# Altium schematic sheet [5] High_Voltage.SchDoc
size A4; DocumentNumber: 7; SheetNumber: 8; SheetTotal: 10
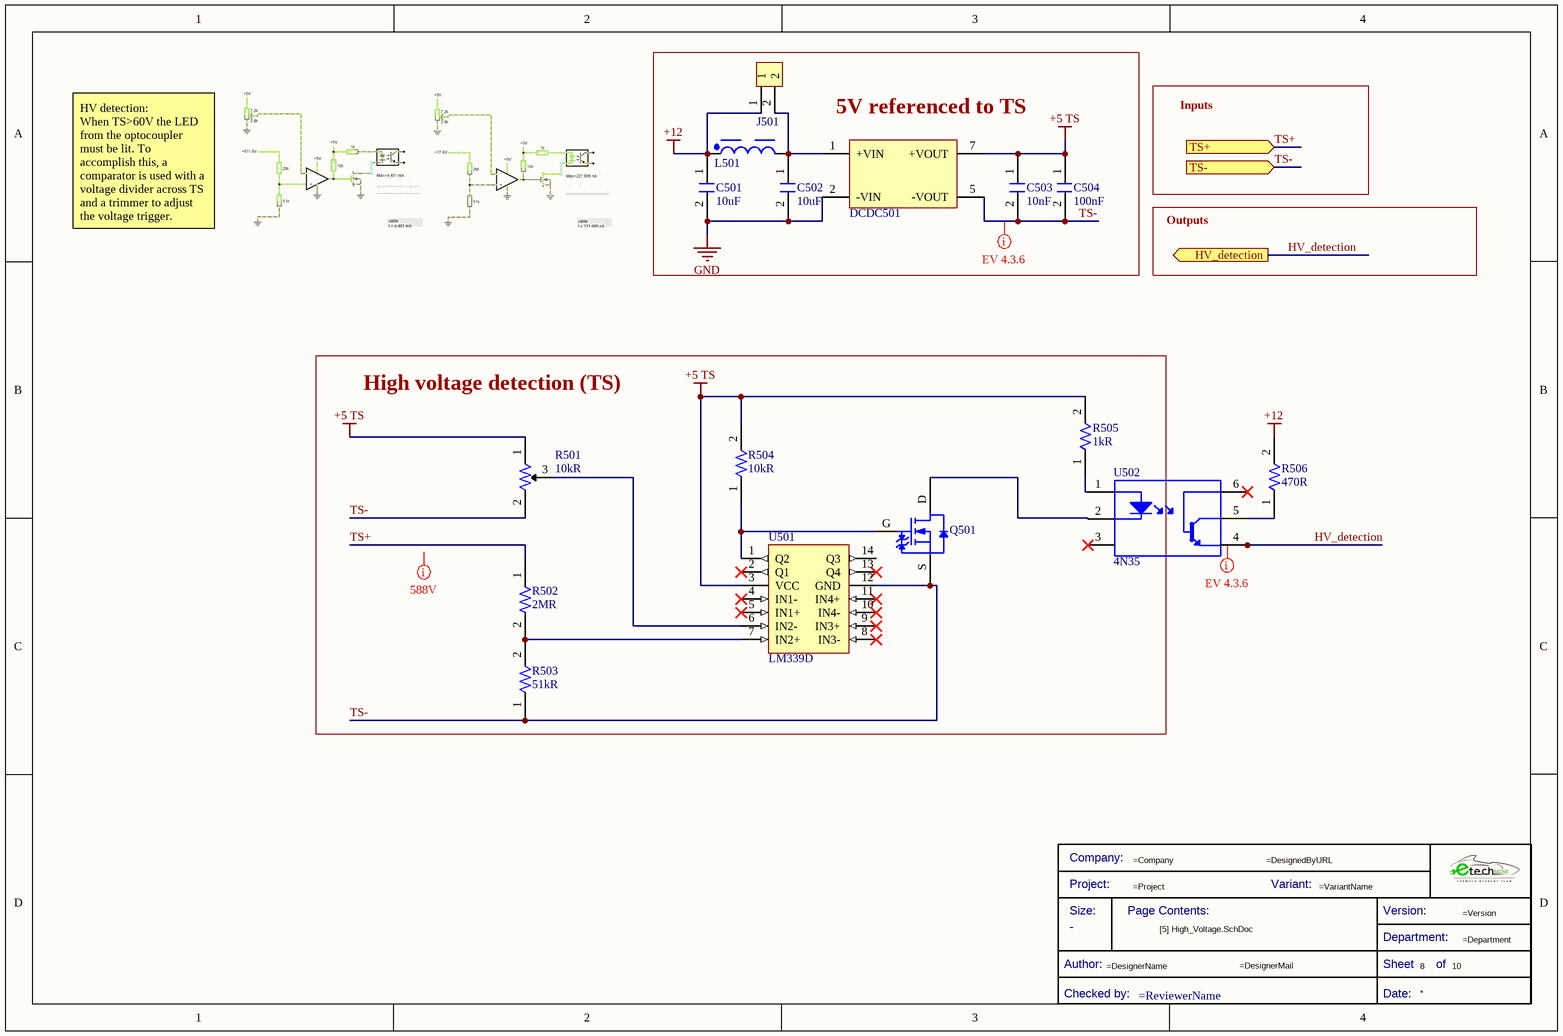
[diagram p0: [5] High_Voltage.SchDoc]

## Parts
*  Title Block_template  (value not drawn)  (graphical)
C501  Capacitance: 10uF  [C10u-50V-1210FNPMLCC-X7R]  (hidden comment: GRJ32ER71H106KE11L)
C502  Capacitance: 10uF  [C10u-50V-1210FNPMLCC-X7R]  (hidden comment: GRJ32ER71H106KE11L)
C503  Capacitance: 10nF  [C0805FNPC-R]  (hidden comment: 885012207092)
C504  Capacitance: 100nF  [C0805FNPC-R]  (hidden comment: 885012207098)
DCDC501  1779405241  [DCDC2W-ISO/1779405X41]  (value not drawn)
J501  61300211121  [J_Pinheader_1x2]  (value not drawn)
L501  744042470  [L_Power_ 47uH]  (value not drawn)
Q501  SQ2318BES-T1_GE3  [TRT-NCH-3/35-CPH]  (value not drawn)
R501  Resistance: 10kR  [R10k-VTR]  (hidden comment: 3296W-1-103LF)
R502  Resistance: 2MR  [R2512FTK]  (hidden comment: R2M-2512FTK)
R503  Resistance: 51kR  [R1206FTK-W]  (hidden comment: CRCW120610K0FKEA)
R504  Resistance: 10kR  [R0805FTK]  (hidden comment: CR0805-JW-103ELF)
R505  Resistance: 1kR  [R0805FTK]  (hidden comment: CR0805-JW-102ELF)
R506  Resistance: 470R  [R0805FTK]  (hidden comment: CR0805-FX-4700GLF)
U501  LM339D  [Array_4_Amp_LM339D]
U502  4N35  [Optocoupler_4N35]

## Blocks framed on the sheet
5V referenced to TS: C501-C504 DCDC501 J501 L501
High voltage detection (TS): Q501 R501-R505 U501

## Ports
HV_detection (out), TS+ (in), TS- (in)

## Nets
+5 TS: C503.1 C504.1 DCDC501.7(+VOUT) R501.1 R504.2 R505.2 U501.3(VCC)
+12: C501.1 J501.1 L501.1 R506.2
GND: C501.2 C502.2 DCDC501.2(-VIN)
HV_detection: U502.4(E) ; port HV_detection
TS+: R502.1 ; port TS+
TS-: C503.2 C504.2 DCDC501.5(-VOUT) Q501.S R501.2 R503.1 U501.12(GND) ; port TS-
NetC502_1: C502.1 DCDC501.1(+VIN) J501.2 L501.2
NetQ501_D: Q501.D U502.2(K)
NetQ501_G: Q501.G R504.1 U501.1(Q2)
NetR501_3: R501.3 U501.6(IN2-)
NetR502_2: R502.2 R503.2 U501.7(IN2+)
NetR505_1: R505.1 U502.1(A)
NetR506_1: R506.1 U502.5(E)

Not connected (* = marked no-connect by the designer): U501 2(Q1)* 4(IN1-)* 5(IN1+)* 8(IN3-)* 9(IN3+)* 10(IN4-)* 11(IN4+)* 13(Q4)* 14(Q3); U502 3(C)* 6(E)*

## Layout directives
mark named EV 4.3.6: (no net found under the mark), TS-
mark named 588V: (no net found under the mark)

## Notes on the sheet
- Inputs
- HV detection:
  When TS>60V the LED from the optocoupler must be lit. To accomplish this, a comparator is used with a voltage divider across TS and a trimmer to adjust the voltage trigger.
- Outputs
- (in symbol Title Block_template) Company:; Project:; Variant:; Size:; Page Contents:; Version:; Department:; Author:; Sheet; of; Checked by:; Date:

## Library data of the parts
* = Title Block_template: Standard Title Block; Category: Title Block; Checked by:: =ReviewerName; Size: -
C501 C502 = C10u-50V-1210FNPMLCC-X7R: Multilayer Ceramic Capacitors MLCC - SMD/SMT 1210 10uF 50volts X7R +/-10% Soft Term; Manufacturer: Murata; Voltage Rating: 50V; Tolerance: 10%; .Creator: DR; Supplier 1: Avnet; Manufacturer Part Number: GRJ32ER71H106KE11L; RoHS: Yes; Category: Ceramic Capacitors; Stock 1: 19000; Pricing 1: 1000=0,33327, 2000=0,32389, 4000=0,31450, 6000=0,30511, 8000=0,29572 (USD); Mount: Surface Mount; Case/Package: 1210; Case Code (Metric): 3225; Case Code (Imperial): 1210; Min Operating Temperature: -55°C; Max Operating Temperature: 125°C; Packaging: Tape and Reel; Features: Soft Termination; Length: 0.126inch; Width: 0.098inch; Thickness: 0.11inch; RoHS Compliant: Yes; ComponentLink1URL: https://eu.mouser.com/datasheet/2/281/GRJ32ER71H106KE11_01-1977929.pdf; ComponentLink1Description: Datasheet; Supplier Part Number 1: GRJ32ER71H106KE11L
C503 = C10n-50V-0805FNPC-X7R: Cap, 0.01ΜF, 50V, 10%, X7R, 0805; Manufacturer 1: Wurth Electronics; .Creator: DR; Supplier 1: RSComponents; Manufacturer Part Number 1: 885012207092; RoHS: Yes; Category: Ceramic Capacitors; Stock 1: 1; Pricing 1: 4000=0,03200, 12000=0,03100 (USD); Mount: Surface Mount; Case/Package: 0805; Case Code (Metric): 2012; Case Code (Imperial): 0805; Min Operating Temperature: -55°C; Max Operating Temperature: 125°C; Packaging: Cut Tape; Voltage Rating: 50V; Dielectric: X7R; Tolerance: 10%; Voltage Rating (DC): 50V; Length: 0.079inch; Width: 0.049inch; Thickness: 0.035inch; REACH SVHC: Unknown; RoHS Compliant: Yes; ComponentLink1URL: http://www.farnell.com/datasheets/1958497.pdf?src-supplier=Farnell; ComponentLink1Description: http://www.farnell.com/datasheets/1958497.pdf?src-supplier=Farnell; ComponentLink2URL: http://www.farnell.com/datasheets/1958497.pdf?src-supplier=Element14; ComponentLink2Description: http://www.farnell.com/datasheets/1958497.pdf?src-supplier=Element14; ComponentLink3URL: http://www.farnell.com/datasheets/1958497.pdf?src-supplier=Newark; ComponentLink3Description: http://www.farnell.com/datasheets/1958497.pdf?src-supplier=Newark; ComponentLink4URL: https://katalog.we-online.de/pbs/datasheet/885012207092.pdf?src-supplier=Digi-Key; ComponentLink4Description: https://katalog.we-online.de/pbs/datasheet/885012207092.pdf?src-supplier=Digi-Key; Supplier Part Number 1: 1813941
C504 = C100n-50V-0805FNPC-X7R: Cap, 0.1ΜF, 50V, 10%, X7R, 0805; Manufacturer 1: Wurth Electronics; .Creator: DR; Supplier 1: RSComponents; Manufacturer Part Number 1: 885012207098; RoHS: Yes; Category: Ceramic Capacitors; Stock 1: 8000; Pricing 1: 100=0,10200, 500=0,07100, 2000=0,06100 (GBP); Mount: Surface Mount; Case/Package: 0805; Case Code (Metric): 2012; Case Code (Imperial): 0805; Min Operating Temperature: -55°C; Max Operating Temperature: 125°C; Packaging: Cut Tape; Voltage Rating: 50V; Dielectric: X7R; Tolerance: 10%; Voltage Rating (DC): 50V; Length: 0.079inch; Width: 0.049inch; Thickness: 0.035inch; REACH SVHC: Unknown; RoHS Compliant: Yes; ComponentLink1URL: http://www.farnell.com/datasheets/1958498.pdf?src-supplier=Farnell; ComponentLink1Description: http://www.farnell.com/datasheets/1958498.pdf?src-supplier=Farnell; ComponentLink2URL: http://www.farnell.com/datasheets/1958498.pdf?src-supplier=Element14; ComponentLink2Description: http://www.farnell.com/datasheets/1958498.pdf?src-supplier=Element14; ComponentLink3URL: https://katalog.we-online.de/pbs/datasheet/885012207098.pdf?src-supplier=Digi-Key; ComponentLink3Description: https://katalog.we-online.de/pbs/datasheet/885012207098.pdf?src-supplier=Digi-Key; ComponentLink4URL: http://www.farnell.com/datasheets/1958498.pdf?src-supplier=Newark; ComponentLink4Description: http://www.farnell.com/datasheets/1958498.pdf?src-supplier=Newark; Supplier Part Number 1: 1813493
DCDC501 = DCDC-ISO-2W/12V/5V: WPME-FISM Fixed Isolated Module, SIP-7, 10.8-13.2Vin, 5Vout; Manufacturer: Wurth Elektronik; Input Voltage Max: 13.2V; Input Voltage Min: 10.8V; Input Voltage: 12V; Output Voltage: 5V; Isolation Voltage: 4kV; ComponentLink2Description: Datasheet; Height: 10.16mm; Packaging: Tube; Width: 7.05mm; ComponentLink2URL: https://www.we-online.com/catalog/datasheet/1779405141.pdf; Length: 19.65mm; Manufacturer Part Number: 1779405241; ComponentLink1Description: Manufacturer Link; Operating Temperature Max: 105°C; Mount: THT; ComponentLink1URL: http://www.we-online.de; Case/Size Code: SIP-7; Operating Temperature Min: -40°C; Component Type: MagI3C FISM
J501 = J_Jumper: CONN HEADER 2 POS 2.54; Manufacturer: Molex; Temperature rating: -40° to +105°C; Category type: PCB-PCB; Product name: Pin Header; Maximum current: 3 A; Maximum voltage: 250 V AC; Connections: 1x2; Current Rating: 3A; Voltage Rating: 250V; Number of Positions: 2; Gender: Male; Connector Type: Male Pin; Pitch: 0.1inch; .Creator: GP; Category: Connector; ComponentLink1Description: Datasheet; ComponentLink1URL: https://www.we-online.com/catalog/datasheet/61300211121.pdf; ComponentLink2Description: Where buy it; ComponentLink2URL: https://www.we-online.com/catalog/en/PHD_2_54_THT_PIN_HEADER_6130XX11121?sq=61300211121&sp=https%3A%2F%2Fwww.we-online.com%2Fweb%2Fen%2Fwuerth_elektronik%2Fsearchpage.php%3Fsearch%3D61300211121#61300211121; Manufacturer part number: 61300211121; Supplier: Würth Elektronik; RoHS: *; Application: Shortcircuit; Flammability: 94V-0; Orientation: Vertical; Mount: Through hole; Supplier 1: RSComponents; Stock 1: 1855; Pricing 1: 5=0,14100, 50=0,09700, 100=0,07800, 200=0,07300, 500=0,06800 (USD); Contact Plating: Gold; Housing Material: PBT; Contact Material: Copper Alloy,Copper; Color: Black; Min Operating Temperature: -40°C; Max Operating Temperature: 125°C; Number of Rows: 1; Contact Gender: Male; Packaging: Bulk; Termination: Through Hole; Number of Contacts: 2; Contact Mating Length: 0.236inch; REACH SVHC: Unknown; Lead Free: Lead Free; ComponentLink3URL: https://datasheet.ciiva.com/13619/6130xx11121-48870-13619345.pdf?src-supplier=Mouser; ComponentLink3Description: https://datasheet.ciiva.com/13619/6130xx11121-48870-13619345.pdf?src-supplier=Mouser; Supplier Part Number 1: 8281581
L501 = L_47uH_0.6A: WE-TPC SMT Tiny Power Inductor, size 4818, 47uH, 0.62A, 540mOhm; Manufacturer: Wurth Elektronik; Case/Size Code: 4818; Saturation Current: 0.45A; Self Resonant Frequency: 15MHz; Manufacturer Part Number: 744042470; Category: Power Inductors; Match Code: WE-TPC; ComponentLink1Description: Website Link; ComponentLink1URL: https://www.we-online.com/redexpert/article/744042470?ad; ComponentLink2Description: Datasheet Link; ComponentLink2URL: https://www.we-online.com/redexpert/spec/744042470?ad; Mount: Surface Mount; Operating Temperature Max: 125°C; Operating Temperature Min: -40°C; Packaging: Tape and Reel; Length: 4.8mm; Width: 4.8mm; Height: 1.8mm; DC Resistance: 540mOhm; Inductance: 47uH; Rated Current: 0.62A
Q501 = TRT-NCH-8/40-SQ: Automotive N-channel 40 V (d-s) 175C Mosfet SOT-23; Manufacturer 1: Vishay; Id: 8A; Vds: 40V; .Creator: DO; Supplier 1: Newark; Manufacturer Part Number 1: SQ2318BES-T1_GE3; RoHS: No; Pricing 1: 1=0,71500, 5=0,71500, 10=0,64400, 25=0,59000, 50=0,52500, 100=0,47100, 250=0,40800 (USD); Supplier Part Number 1: 81AH9290; ComponentLink1Description: Where to buy; ComponentLink1URL: https://www.mouser.es/ProductDetail/Vishay-Siliconix/SQ2318BES-T1_GE3?qs=sPbYRqrBIVmyZcxPsDt0vA%3D%3D; ComponentLink2Description: Datasheet; ComponentLink2URL: https://www.mouser.es/datasheet/2/427/sq2318bes-1868475.pdf
R501 = R10k-VTR: Trimmer, Cermet, Rest 10 Kilohms, PCB, 25 Turns, Pwr-Rtg 0.5W, 3296 Series; Manufacturer: Bourns; Tolerance: 10%; Power Rating: 500mW; Number of Turns: 25; Temperature Coefficient: 100ppm/°C; Insulation Resistance: 1GR; .Creator: DO; Supplier 1: RSComponents; Manufacturer Part Number: 3296W-1-103LF; RoHS: Yes; Category: Variable Resistors and Potentiometers; Stock 1: 3300; Pricing 1: 50=2,54800, 100=2,31900, 200=2,14000, 300=1,88400, 500=1,55300 (USD); Mount: PCB,Through Hole; Weight: 0.03oz; Color: Blue; Contact Plating: Tin,Matte; Min Operating Temperature: -55°C; Max Operating Temperature: 125°C; Packaging: Rail/Tube; Package Quantity: 50; Termination: Pin; Resistor Type: Cermet; Technology: CERMET; Taper: Linear; Max Power Dissipation: 500mW; Series: 3296; Resistance Tolerance: 10%; Length: 9.53mm; Width: 9.53mm; Height: 0.395inch; Depth: 4.83mm; Radiation Hardening: No; REACH SVHC: No SVHC; Military Standard: Not; Lead Free: Lead Free; RoHS Compliant: Yes; ComponentLink1URL: https://datasheet.ciiva.com/19454/853572-19454866.pdf?src-supplier=Jameco; ComponentLink1Description: https://datasheet.ciiva.com/19454/853572-19454866.pdf?src-supplier=Jameco; ComponentLink2URL: https://datasheet.ciiva.com/11830/0900766b8069ccf4-11830871.pdf?src-supplier=RSComponents; ComponentLink2Description: https://datasheet.ciiva.com/11830/0900766b8069ccf4-11830871.pdf?src-supplier=RSComponents; ComponentLink3URL: https://datasheet.ciiva.com/29122/447277-da-01-en-trimmer-tht3296w-1-103lf-10k-0-5w-29122362.pdf?src-supplier=Conrad; ComponentLink3Description: https://datasheet.ciiva.com/29122/447277-da-01-en-trimmer-tht3296w-1-103lf-10k-0-5w-29122362.pdf?src-supplier=Conrad; ComponentLink4URL: https://datasheet.ciiva.com/26913/3296w-1-103lf-26913885.pdf?src-supplier=IIIC; ComponentLink4Description: https://datasheet.ciiva.com/26913/3296w-1-103lf-26913885.pdf?src-supplier=IIIC; ComponentLink5URL: https://datasheet.ciiva.com/1131/1815117-1131273.pdf?src-supplier=Element14; ComponentLink5Description: https://datasheet.ciiva.com/1131/1815117-1131273.pdf?src-supplier=Element14; ComponentLink6URL: https://datasheet.ciiva.com/18411/70153578-18411561.pdf?src-supplier=Allied+Electronics; ComponentLink6Description: https://datasheet.ciiva.com/18411/70153578-18411561.pdf?src-supplier=Allied+Electronics; ComponentLink7URL: https://datasheet.ciiva.com/3266/3296-3266187.pdf?src-supplier=Avnet; ComponentLink7Description: https://datasheet.ciiva.com/3266/3296-3266187.pdf?src-supplier=Avnet; ComponentLink8URL: https://datasheet.ciiva.com/30093/3296-30093899.pdf?src-supplier=Onlinecomponents.com; ComponentLink8Description: https://datasheet.ciiva.com/30093/3296-30093899.pdf?src-supplier=Onlinecomponents.com; ComponentLink9URL: https://datasheet.ciiva.com/2156/3296-2156893.pdf?src-supplier=Digi-Key; ComponentLink9Description: https://datasheet.ciiva.com/2156/3296-2156893.pdf?src-supplier=Digi-Key; ComponentLink10URL: https://datasheet.ciiva.com/14173/ew3296-dat-e-14173022.pdf?src-supplier=Distrelec; ComponentLink10Description: https://datasheet.ciiva.com/14173/ew3296-dat-e-14173022.pdf?src-supplier=Distrelec; Supplier Part Number 1: 1673377; ComponentLink11Description: Where buy it; ComponentLink11URL: https://es.rs-online.com/web/p/potenciometros-de-ajuste/5219647
R502 = R2M-2512FTK: Current Sense Resistors - SMD 3watts .002ohms 1%; Manufacturer: Vishay Dale; Manufacturer Part Number: WSLP25122L000FEA; Temperature Coefficient: 275ppm/°C; Power Rating: 3W; Supplier 1: Mouser; RoHS: Yes; Category: Chip SMD Resistors; Stock 1: 11994; Pricing 1: 1=1,07000, 10=1,07000, 50=1,07000, 100=1,07000, 1000=0,77100, 10000=0,75500 (USD); Mount: Surface Mount; Case/Package: 2512; Case Code (Imperial): 2512; Case Code (Metric): 6432; Weight: 0.001429oz; Size Code: 2512; Min Operating Temperature: -65°C; Max Operating Temperature: 170°C; Tolerance: 1%; Packaging: Tape and Reel; Resistor Type: Metal Strip; Package Quantity: 2000; Termination: SMD/SMT; Series: WSLP; Length: 6.4mm; Width: 3.2mm; Height: 0.635mm; RoHS Compliant: Yes; Lead Free: Lead Free; ComponentLink1URL: https://datasheet.ciiva.com/48527/wslp-48527354.pdf?src-supplier=Avnet; ComponentLink1Description: https://datasheet.ciiva.com/48527/wslp-48527354.pdf?src-supplier=Avnet; Supplier Part Number 1: 71-WSLP25122L000FEA
R503 = R51k-1206FTK: Res Thick Film 1206 51K Ohm 1% 1/4W ±100ppm/°C Molded SMD SMD Punched Carrier T/R; Manufacturer: Panasonic; Manufacturer Part Number: ERJ-S08F5102V; Power Rating: 250mW; Voltage Rating: 150V; Voltage Rating (DC): 200V; Current Rating: 2A; .Creator: DO; Category: Resistor; ComponentLink1Description: Datasheet; ComponentLink1URL: https://docs.rs-online.com/bca8/A700000006404581.pdf; ComponentLink2Description: Where buy it; ComponentLink2URL: https://es.rs-online.com/web/p/resistencias-de-montaje-en-superficie/6791765; Supplier 1: Mouser; RoHS: Yes; Stock 1: 4091; Pricing 1: 1=0,31000, 10=0,26700, 50=0,26700, 100=0,10700, 1000=0,05100, 10000=0,03400 (USD); Mount: Surface Mount; Case/Package: 1206; Case Code (Metric): 3216; Case Code (Imperial): 1206; Contact Plating: Tin; Min Operating Temperature: -55°C; Max Operating Temperature: 155°C; Packaging: Tape and Reel; Tolerance: 1%; Package Quantity: 5000; Resistor Type: Thick Film; Number of Terminations: 2; Temperature Coefficient: 100ppm/°C; Max Power Dissipation: 250mW; Features: Anti-Sulfur; Series: ERJ; Construction: Rectangular; Length: 3.2mm; Width: 0.063inch; Height: 0.028inch; Depth: 1.6mm; Military Standard: Not; Lead Free: Lead Free; RoHS Compliant: Yes; ComponentLink3URL: https://datasheet.ciiva.com/24023/aoa0000ce5-24023518.pdf?src-supplier=Mouser; ComponentLink3Description: https://datasheet.ciiva.com/24023/aoa0000ce5-24023518.pdf?src-supplier=Mouser; ComponentLink4URL: https://datasheet.ciiva.com/9189/aoa0000ce5-9189211.pdf?src-supplier=Avnet; ComponentLink4Description: https://datasheet.ciiva.com/9189/aoa0000ce5-9189211.pdf?src-supplier=Avnet; Supplier Part Number 1: 667-ERJ-S08F5102V
R504 = R10k-0805FTK: BOURNS         CR0805-JW-103ELF            Surface Mount Chip Resistor, Thick Film, CR Series, 10 kohm, 125 mW,  5%, 150 V; Temperature Coefficient: 200ppm/°C; Power Rating: 125mW; Voltage Rating: 150V; Voltage Rating (DC): 100V; .Creator: DR; Supplier 1: Arrow Electronics; Manufacturer 1: Bourns; Manufacturer Part Number 1: CR0805-JW-103ELF; RoHS: Yes; Category: Chip SMD Resistors; Stock 1: 57566; Pricing 1: 1=0,05790, 10=0,01540, 25=0,01340, 100=0,00340 (USD); Mount: Surface Mount; Case/Package: 0805; Number of Pins: 2; Contact Plating: Tin; Case Code (Metric): 2012; Case Code (Imperial): 0805; Min Operating Temperature: -55°C; Max Operating Temperature: 155°C; Tolerance: 5%; Resistor Type: Thick Film; Package Quantity: 1; Packaging: Tape and Reel; Number of Terminations: 2; Termination: SMD/SMT; Max Power Dissipation: 125mW; Features: Moisture Resistant; Series: CR0805; Construction: Rectangular; Resistance Tolerance: 5%; Technology: THICK FILM; Length: 2mm; Width: 1.25mm; Height: 0.5mm; Depth: 1.25mm; Thickness: 508um; Radiation Hardening: No; REACH SVHC: No SVHC; Military Standard: Not; RoHS Compliant: Yes; ComponentLink1URL: https://datasheet.ciiva.com/11821/0900766b80fcdb72-11821135.pdf?src-supplier=RSComponents; ComponentLink1Description: https://datasheet.ciiva.com/11821/0900766b80fcdb72-11821135.pdf?src-supplier=RSComponents; ComponentLink2URL: https://datasheet.ciiva.com/9122/chpreztr-9122374.pdf?src-supplier=Avnet; ComponentLink2Description: https://datasheet.ciiva.com/9122/chpreztr-9122374.pdf?src-supplier=Avnet; ComponentLink3URL: https://datasheet.ciiva.com/22693/1902866-22693254.pdf?src-supplier=Element14; ComponentLink3Description: https://datasheet.ciiva.com/22693/1902866-22693254.pdf?src-supplier=Element14; ComponentLink4URL: https://datasheet.ciiva.com/7986/691949-7986187.pdf?src-supplier=Element14; ComponentLink4Description: https://datasheet.ciiva.com/7986/691949-7986187.pdf?src-supplier=Element14; ComponentLink5URL: https://datasheet.ciiva.com/30065/159chpreztr-30065976.pdf?src-supplier=Onlinecomponents.com; ComponentLink5Description: https://datasheet.ciiva.com/30065/159chpreztr-30065976.pdf?src-supplier=Onlinecomponents.com; ComponentLink6URL: https://datasheet.ciiva.com/16783/70154685-16783482.pdf?src-supplier=Allied+Electronics; ComponentLink6Description: https://datasheet.ciiva.com/16783/70154685-16783482.pdf?src-supplier=Allied+Electronics; ComponentLink7URL: https://datasheet.ciiva.com/5548/chpreztr-5548491.pdf?src-supplier=Mouser; ComponentLink7Description: https://datasheet.ciiva.com/5548/chpreztr-5548491.pdf?src-supplier=Mouser; ComponentLink8URL: https://datasheet.ciiva.com/6559/chpreztr-6559900.pdf?src-supplier=Digi-Key; ComponentLink8Description: https://datasheet.ciiva.com/6559/chpreztr-6559900.pdf?src-supplier=Digi-Key; ComponentLink9URL: https://datasheet.ciiva.com/6559/chpreztr-6559901.pdf?src-supplier=Digi-Key; ComponentLink9Description: https://datasheet.ciiva.com/6559/chpreztr-6559901.pdf?src-supplier=Digi-Key; ComponentLink10URL: https://datasheet.ciiva.com/7985/1856384-7985869.pdf?src-supplier=Element14; ComponentLink10Description: https://datasheet.ciiva.com/7985/1856384-7985869.pdf?src-supplier=Element14; ComponentLink11URL: https://datasheet.ciiva.com/48692/001055517-da-01-en-smd-wid-cr0805-jw-103elf-10k-ohm-1-8w-48692118.pdf?src-supplier=Conrad; ComponentLink11Description: https://datasheet.ciiva.com/48692/001055517-da-01-en-smd-wid-cr0805-jw-103elf-10k-ohm-1-8w-48692118.pdf?src-supplier=Conrad; Supplier Part Number 1: CR0805-JW-103ELF
R505 = R1k-0805FTK: Res Thick Film 0805 1K Ohm 5% 1/8W ±200ppm/°C Molded SMD SMD Paper Tape on Plastic Reel; Manufacturer 1: Bourns; Voltage Rating (DC): 150V; Power Rating: 125mW; .Creator: GP; Supplier 1: Arrow Electronics; Manufacturer Part Number 1: CR0805-JW-102ELF; RoHS: Yes; Category: Chip SMD Resistors; Stock 1: 27510; Pricing 1: 1=0,05930, 10=0,03510, 25=0,01790, 100=0,00800, 250=0,00790, 500=0,00590, 1000=0,00360, 3000=0,00350, 6000=0,00250 (USD); Mount: Surface Mount; Case/Package: 0805; Number of Pins: 2; Contact Plating: Tin; Case Code (Metric): 2012; Case Code (Imperial): 0805; Min Operating Temperature: -55°C; Max Operating Temperature: 155°C; Resistor Type: Thick Film; Tolerance: 5%; Temperature Coefficient: 200ppm/°C; Features: Moisture Resistant; Package Quantity: 1; Packaging: Tape and Reel; Voltage Rating: 150V; Number of Terminations: 2; Termination: SMD/SMT; Max Power Dissipation: 125mW; Length: 2mm; Width: 1.25mm; Height: 0.5mm; Thickness: 508um; Depth: 1.25mm; Radiation Hardening: No; Lead Free: Lead Free; REACH SVHC: No SVHC; Military Standard: Not; ComponentLink1URL: https://datasheet.ciiva.com/11821/0900766b80fcdb72-11821134.pdf?src-supplier=RSComponents; ComponentLink1Description: https://datasheet.ciiva.com/11821/0900766b80fcdb72-11821134.pdf?src-supplier=RSComponents; ComponentLink2URL: https://datasheet.ciiva.com/15225/getdatasheetpartid-78155-15225381.pdf?src-supplier=Verical; ComponentLink2Description: https://datasheet.ciiva.com/15225/getdatasheetpartid-78155-15225381.pdf?src-supplier=Verical; ComponentLink3URL: https://datasheet.ciiva.com/22693/1902866-22693253.pdf?src-supplier=Element14; ComponentLink3Description: https://datasheet.ciiva.com/22693/1902866-22693253.pdf?src-supplier=Element14; ComponentLink4URL: https://datasheet.ciiva.com/7986/1856384-7986184.pdf?src-supplier=Element14; ComponentLink4Description: https://datasheet.ciiva.com/7986/1856384-7986184.pdf?src-supplier=Element14; ComponentLink5URL: https://datasheet.ciiva.com/7985/1856384-7985867.pdf?src-supplier=Element14; ComponentLink5Description: https://datasheet.ciiva.com/7985/1856384-7985867.pdf?src-supplier=Element14; ComponentLink6URL: https://datasheet.ciiva.com/30242/159chpreztr-30242765.pdf?src-supplier=Onlinecomponents.com; ComponentLink6Description: https://datasheet.ciiva.com/30242/159chpreztr-30242765.pdf?src-supplier=Onlinecomponents.com; ComponentLink7URL: https://datasheet.ciiva.com/6547/chpreztr-6547359.pdf?src-supplier=Digi-Key; ComponentLink7Description: https://datasheet.ciiva.com/6547/chpreztr-6547359.pdf?src-supplier=Digi-Key; Supplier Part Number 1: CR0805-JW-102ELF
R506 = R470-0805FTK: Res Thick Film 0805 470 Ohm 1% 1/8W ±100ppm/°C Molded SMD SMD Paper Tape on Plastic Reel; Manufacturer 1: Bourns; Power Rating: 125mW; Voltage Rating: 150V; .Creator: DR; Supplier 1: Arrow Electronics; Manufacturer Part Number 1: CR0805-FX-4700GLF; RoHS: Yes; Category: Chip SMD Resistors; Stock 1: 12623; Pricing 1: 1=0,00990, 10=0,00980, 25=0,00950, 50=0,00940, 100=0,00930, 250=0,00920, 500=0,00910, 1000=0,00890, 3000=0,00870, 6000=0,00860 (USD); Mount: Surface Mount; Case/Package: 0805; Number of Pins: 2; Case Code (Imperial): 0805; Case Code (Metric): 2012; Contact Plating: Tin; Min Operating Temperature: -55°C; Max Operating Temperature: 155°C; Packaging: Tape and Reel; Tolerance: 1%; Resistor Type: Thick Film; Termination: SMD/SMT; Temperature Coefficient: 100ppm/°C; Voltage Rating (DC): 150V; Features: Moisture Resistant; Series: CR0805; Max Power Dissipation: 125mW; Number of Terminations: 2; Resistance Tolerance: 1%; Construction: Rectangular; Technology: THICK FILM; Length: 2mm; Height: 0.5mm; Depth: 1.25mm; Thickness: 508um; Radiation Hardening: No; REACH SVHC: No SVHC; Military Standard: Not; ComponentLink1URL: https://datasheet.ciiva.com/11808/0900766b80fcdb72-11808686.pdf?src-supplier=RSComponents; ComponentLink1Description: https://datasheet.ciiva.com/11808/0900766b80fcdb72-11808686.pdf?src-supplier=RSComponents; ComponentLink2URL: https://datasheet.ciiva.com/7985/1856384-7985880.pdf?src-supplier=Element14; ComponentLink2Description: https://datasheet.ciiva.com/7985/1856384-7985880.pdf?src-supplier=Element14; ComponentLink3URL: https://datasheet.ciiva.com/22693/1902866-22693247.pdf?src-supplier=Element14; ComponentLink3Description: https://datasheet.ciiva.com/22693/1902866-22693247.pdf?src-supplier=Element14; ComponentLink4URL: https://datasheet.ciiva.com/5541/chpreztr-5541930.pdf?src-supplier=Mouser; ComponentLink4Description: https://datasheet.ciiva.com/5541/chpreztr-5541930.pdf?src-supplier=Mouser; Supplier Part Number 1: CR0805-FX-4700GLF
U501 = Array_4_Amp_LM339D: Comparator Quad ±18V/36V 14-Pin SOIC Tube; Manufacturer: Texas Instruments; Number of Channels: 4; Nominal Supply Current: 2mA; Output Current: 20mA; Quiescent Current: 2.5mA; Max Supply Voltage: 30V; Min Supply Voltage: 2V; Min Dual Supply Voltage: 1V; Max Dual Supply Voltage: 15V; Voltage Gain: 106.02dB; Max Supply Current: 500uA; Input Bias Current: 250nA; Output Current per Channel: 6mA; Input Offset Voltage (Vos): 5mV; Response Time: 0.3us; Output Type: TTL; Dual Supply Voltage: 9V; .Creator: DO; Supplier 1: Digi-Key; RoHS: Yes; Category: Amplifiers - Op Amps, Buffer, Instrumentation; Stock 1: 10834; Pricing 1: 1=0,93000, 10=0,83500, 25=0,79240, 100=0,65090, 250=0,60848, 500=0,53774, 1000=0,46725 (USD); Mount: Surface Mount; Case/Package: SOIC; Number of Pins: 14; Contact Plating: Gold; Weight: 0.004318oz; Min Operating Temperature: 0°C; Max Operating Temperature: 70°C; Packaging: Rail/Tube; Package Quantity: 50; Number of Elements: 4; Supply Current: 2mA; Technology: BIPOLAR; Max Input Current: 250nA; Series: LM339; Length: 8.65mm; Width: 3.91mm; Height: 1.58mm; Radiation Hardening: No; REACH SVHC: No SVHC; Lead Free: Lead Free; RoHS Compliant: Yes; ComponentLink1URL: https://datasheet.ciiva.com/15131/getdatasheetpartid-248452-15131099.pdf?src-supplier=Verical; ComponentLink1Description: https://datasheet.ciiva.com/15131/getdatasheetpartid-248452-15131099.pdf?src-supplier=Verical; ComponentLink2URL: https://datasheet.ciiva.com/1483/1831045-1483000.pdf?src-supplier=Element14; ComponentLink2Description: https://datasheet.ciiva.com/1483/1831045-1483000.pdf?src-supplier=Element14; ComponentLink3URL: https://datasheet.ciiva.com/1827/lm139a-1827534.pdf?src-supplier=Digi-Key; ComponentLink3Description: https://datasheet.ciiva.com/1827/lm139a-1827534.pdf?src-supplier=Digi-Key; ComponentLink4URL: https://datasheet.ciiva.com/2970/lm2901-2970484.pdf?src-supplier=Avnet; ComponentLink4Description: https://datasheet.ciiva.com/2970/lm2901-2970484.pdf?src-supplier=Avnet; ComponentLink5URL: https://datasheet.ciiva.com/48712/001010753-da-01-en-ic-quad-diff-comp-lm339d-soic-14-tid-48712470.pdf?src-supplier=Conrad; ComponentLink5Description: https://datasheet.ciiva.com/48712/001010753-da-01-en-ic-quad-diff-comp-lm339d-soic-14-tid-48712470.pdf?src-supplier=Conrad; Supplier Part Number 1: 296-1013-5-ND; ComponentLink6Description: Where buy it; ComponentLink6URL: https://es.rs-online.com/web/p/comparadores/0858411; Manufacturer Part Number: LM339D
U502 = Optocoupler_4N35: Optocoupler DC-IN 1-CH Transistor With Base DC-OUT 6-Pin PDIP SMD T/R; Manufacturer: Vishay Lite-On; Manufacturer Part Number: CNY17-4S-TA1; Number of Channels: 1; Max Power Dissipation: 250mW; Isolation Voltage: 5kV; Output Voltage: 70V; Forward Voltage: 1.65V; Rise Time: 10000ns; Collector Emitter Saturation Voltage: 300mV; Max Input Current: 60mA; Reverse Breakdown Voltage: 6V; Input Type: DC; Current Transfer Ratio: 320%; Output Current per Channel: 150mA; .Creator: DO; Supplier 1: RSComponents; RoHS: Yes; Category: Optocouplers; Stock 1: 1; Pricing 1: 50=0,27200, 250=0,25600, 500=0,24000, 1250=0,22500, 2500=0,21200 (USD); Mount: Surface Mount; Case/Package: SMD/SMT; Number of Pins: 6; Min Operating Temperature: -55°C; Max Operating Temperature: 100°C; Packaging: Tape and Reel; Package Quantity: 1000; Power Dissipation: 250mW; Collector Emitter Voltage (VCEO): 70V; Max Output Voltage: 70V; Number of Elements: 1; Series: -; Forward Current: 60mA; Collector-emitter Voltage-Max: 300mV; Fall Time: 10000ns; Number of Circuits: 1; Max Collector Current: 150mA; Radiation Hardening: No; Lead Free: Lead Free; RoHS Compliant: Yes; ComponentLink1URL: https://datasheet.ciiva.com/15118/getdatasheetpartid-187668-15118874.pdf?src-supplier=Verical; ComponentLink1Description: https://datasheet.ciiva.com/15118/getdatasheetpartid-187668-15118874.pdf?src-supplier=Verical; ComponentLink2URL: https://datasheet.ciiva.com/6573/s-110-cny17-6573733.pdf?src-supplier=Digi-Key; ComponentLink2Description: https://datasheet.ciiva.com/6573/s-110-cny17-6573733.pdf?src-supplier=Digi-Key; Supplier Part Number 1: 1278380P; ComponentLink3Description: Where buy it; ComponentLink3URL: https://es.rs-online.com/web/p/circuitos-integrados-optoacopladores/1257571